# EAGLE design M307 (EAGLE 6.6.0)
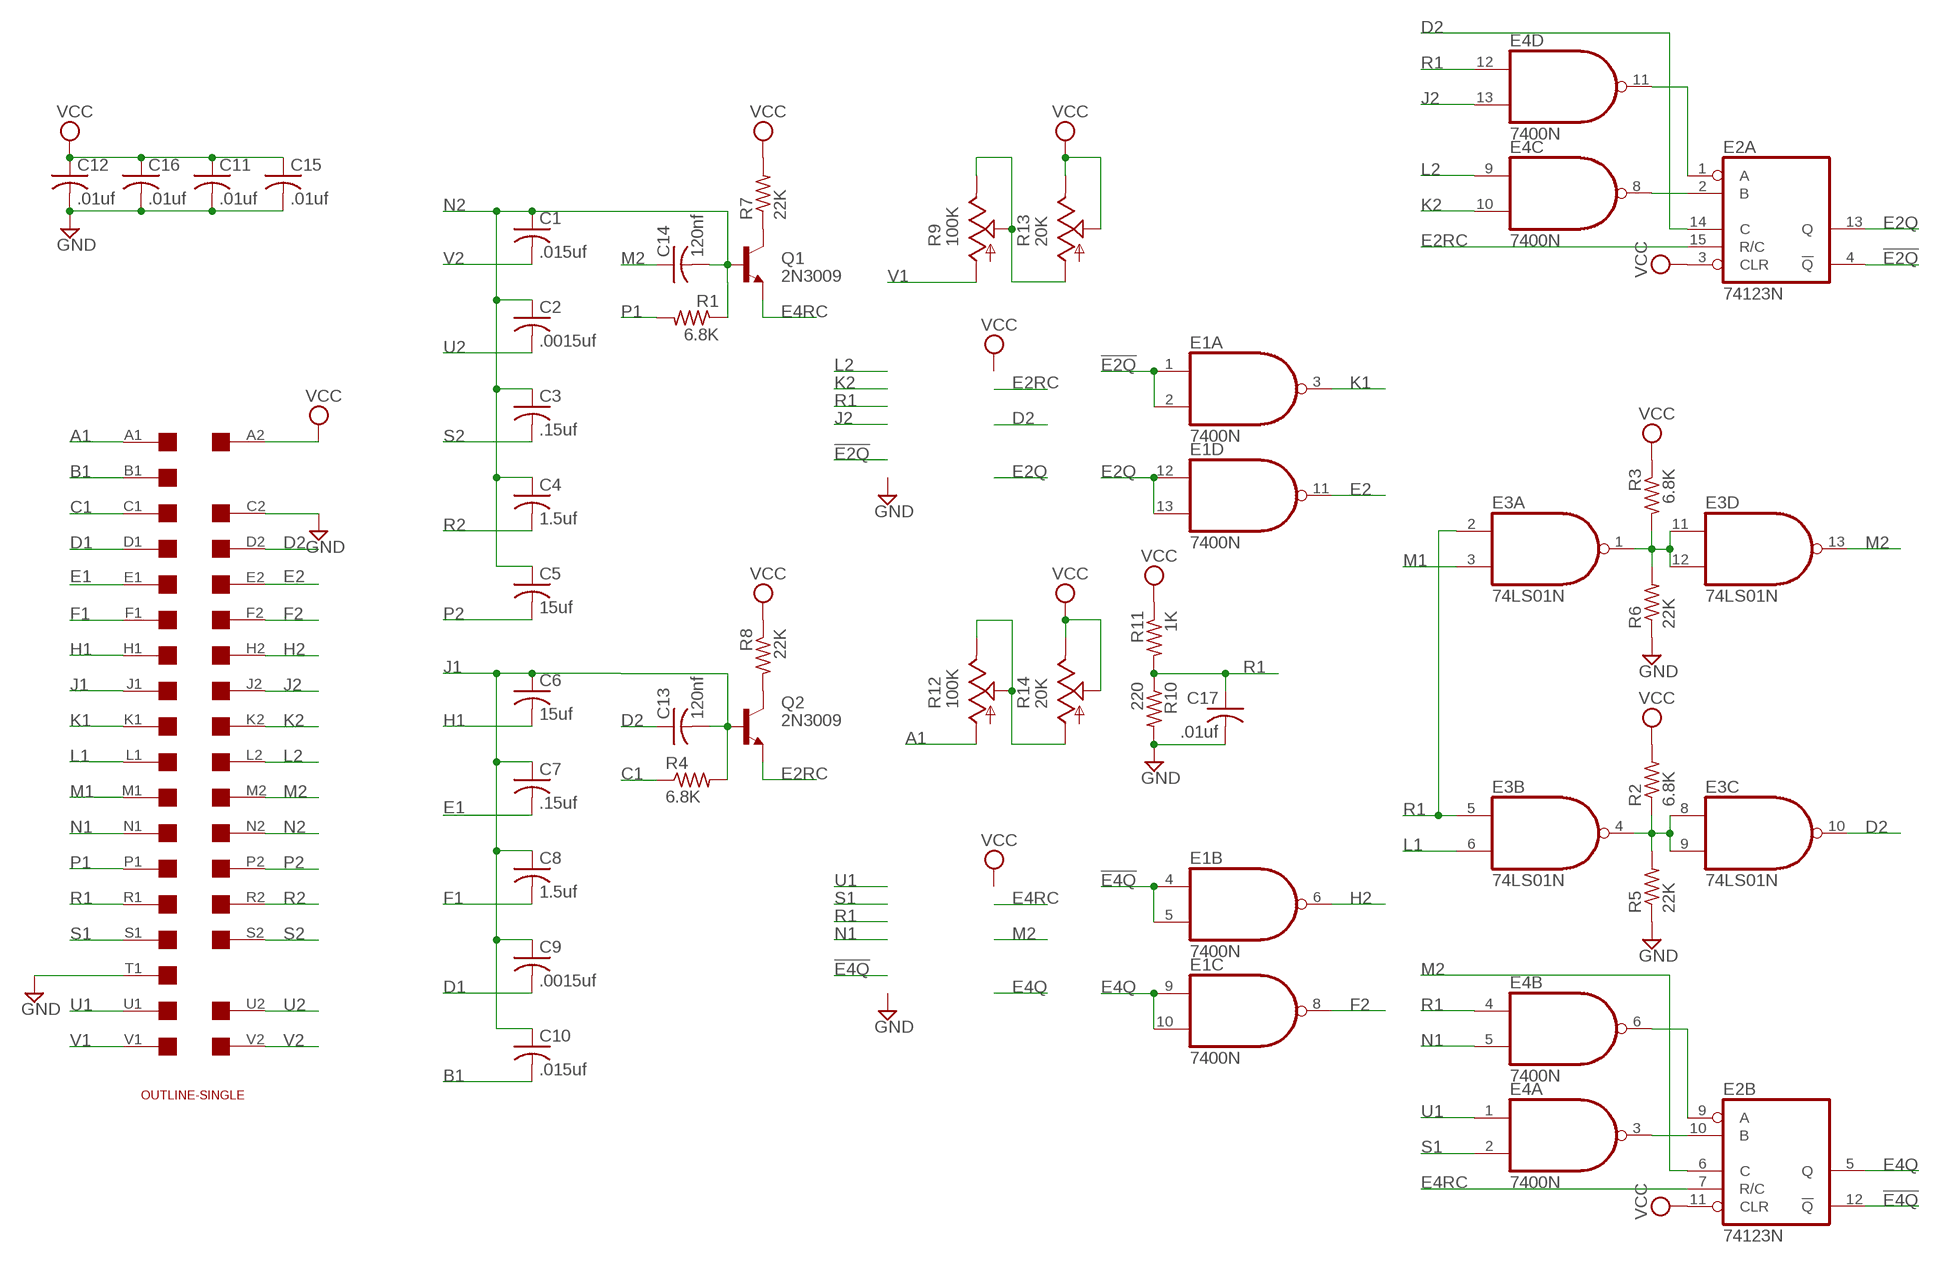
[diagram p0: schematic, sheet 1]

## Parts
C1  .015uf  C-US150-054X183  [C150-054X183]
C2  .0015uf  C-US050-025X075  [C050-025X075]
C3  .15uf  C-US102-043X133  [C102-043X133]
C4  1.5uf  C-US150-054X183  [C150-054X183]
C5  15uf  C-US150-054X183  [C150-054X183]
C6  15uf  C-US150-054X183  [C150-054X183]
C7  .15uf  C-US102-043X133  [C102-043X133]
C8  1.5uf  C-US150-054X183  [C150-054X183]
C9  .0015uf  C-US050-025X075  [C050-025X075]
C10  .015uf  C-US150-054X183  [C150-054X183]
C11  .01uf  C-US050-025X075  [C050-025X075]
C12  .01uf  C-US050-025X075  [C050-025X075]
C13  120nf  C-US075-032X103  [C075-032X103]
C14  120nf  C-US075-032X103  [C075-032X103]
C15  .01uf  C-US050-025X075  [C050-025X075]
C16  .01uf  C-US050-025X075  [C050-025X075]
C17  .01uf  C-US050-025X075  [C050-025X075]
E1  7400N  [DIL14]
E2  74123N  [DIL16]
E3  74LS01N  [DIL14]
E4  7400N  [DIL14]
Q1  2N3009  2N3019-NPN-TO39-EBC  [TO39]
Q2  2N3009  2N3019-NPN-TO39-EBC  [TO39]
R1  6.8K  R-US_0207/10  [0207/10]
R2  6.8K  R-US_0207/10  [0207/10]
R3  6.8K  R-US_0207/10  [0207/10]
R4  6.8K  R-US_0207/10  [0207/10]
R5  22K  R-US_0207/10  [0207/10]
R6  22K  R-US_0207/10  [0207/10]
R7  22K  R-US_0207/10  [0207/10]
R8  22K  R-US_0207/10  [0207/10]
R9  100K  TRIM_US-PTSPIN  [PT-SPIN]
R10  220  R-US_0207/10  [0207/10]
R11  1K  R-US_0207/10  [0207/10]
R12  100K  TRIM_US-PTSPIN  [PT-SPIN]
R13  20K  TRIM_US-PTSPIN  [PT-SPIN]
R14  20K  TRIM_US-PTSPIN  [PT-SPIN]
U$1  SINGLE  [EDGE-CON2]
U$4  OUTLINE-SINGLE  [SINGLE]

## Nets
!E2Q: E1.1(A:I0) E1.2(A:I1) E2.4(A:!Q)
!E4Q: E1.4(B:I0) E1.5(B:I1) E2.12(B:!Q)
A1: R12.A U$1.A1
B1: C10.2 U$1.B1
C1: R4.1 U$1.C1
D1: C9.2 U$1.D1
D2: C13.1 E2.14(A:C) E3.10(C:O) U$1.D2
E1: C7.2 U$1.E1
E2: E1.11(D:O) U$1.E2
E2Q: E1.12(D:I0) E1.13(D:I1) E2.13(A:Q)
E2RC: E2.15(A:R/C) Q2.1(E)
E4Q: E1.9(C:I0) E1.10(C:I1) E2.5(B:Q)
E4RC: E2.7(B:R/C) Q1.1(E)
F1: C8.2 U$1.F1
F2: E1.8(C:O) U$1.F2
GND [power]: C11.2 C12.2 C15.2 C16.2 C17.2 R5.1 R6.1 R10.2 U$1.C2 U$1.T1
H1: C6.2 U$1.H1
H2: E1.6(B:O) U$1.H2
J1: C6.1 C7.1 C8.1 C9.1 C10.1 C13.2 Q2.2(B) R4.2 U$1.J1
J2: E4.13(D:I1) U$1.J2
K1: E1.3(A:O) U$1.K1
K2: E4.10(C:I1) U$1.K2
L1: E3.6(B:I1) U$1.L1
L2: E4.9(C:I0) U$1.L2
M1: E3.3(A:I1) U$1.M1
M2: C14.1 E2.6(B:C) E3.13(D:O) U$1.M2
N1: E4.5(B:I1) U$1.N1
N2: C1.1 C2.1 C3.1 C4.1 C5.1 C14.2 Q1.2(B) R1.1 U$1.N2
N$1: Q1.3(C) R7.1
N$2: E3.4(B:O) E3.8(C:I0) E3.9(C:I1) R2.1 R5.2
N$3: Q2.3(C) R8.2
N$4: E2.10(B:B) E4.3(A:O)
N$5: E3.1(A:O) E3.11(D:I0) E3.12(D:I1) R3.2 R6.2
N$6: E2.9(B:A) E4.6(B:O)
N$7: E2.1(A:A) E4.11(D:O)
N$8: E2.2(A:B) E4.8(C:O)
N$9 [power]: R9.E R9.S R13.A
N$10 [power]: R12.E R12.S R14.A
P1: R1.2 U$1.P1
P2: C5.2 U$1.P2
R1: C17.1 E3.2(A:I0) E3.5(B:I0) E4.4(B:I0) E4.12(D:I0) R10.1 R11.2 U$1.R1
R2: C4.2 U$1.R2
S1: E4.2(A:I1) U$1.S1
S2: C3.2 U$1.S2
U1: E4.1(A:I0) U$1.U1
U2: C2.2 U$1.U2
V1: R9.A U$1.V1
V2: C1.2 U$1.V2
VCC [power]: C11.1 C12.1 C15.1 C16.1 E2.3(A:CLR) E2.11(B:CLR) R2.2 R3.1 R7.2 R8.1 R11.1 R13.E R13.S R14.E R14.S U$1.A2
Unconnected: U$1.B2 U$1.T2

## Power pins joined to a net without a drawn wire
GND: E1.7(P:GND) E2.8(P:GND) E3.7(P:GND) E4.7(P:GND)
VCC: E1.14(P:VCC) E2.16(P:VCC) E3.14(P:VCC) E4.14(P:VCC)

## Library data of the parts
C1-C17 = rcl:C-US: CAPACITOR, American symbol
E1 E4 = 74xx-us:74*00: Quad 2-input NAND gate
E2 = 74xx-us:74*123: Retriggerable monostable MULTIVIBRATOR
E3 = 74xx-us:74*01: Quad 2-input NAND gate, open collector
Q1 Q2 = transistor:*-NPN-: NPN Transistror BF959 corrected 2008.03.06
R1-R8 R10 R11 = rcl:R-US_: RESISTOR, American symbol
R9 R12-R14 = pot:TRIM_US-: POTENTIOMETER
U$1 = dec-con:SINGLE: Single-Height DEC board
U$4 = dec-con:OUTLINE-*: Board outlines for DEC boards.

## Net classes
1 power: width 0.508 mm, clearance 0.508 mm

## Board
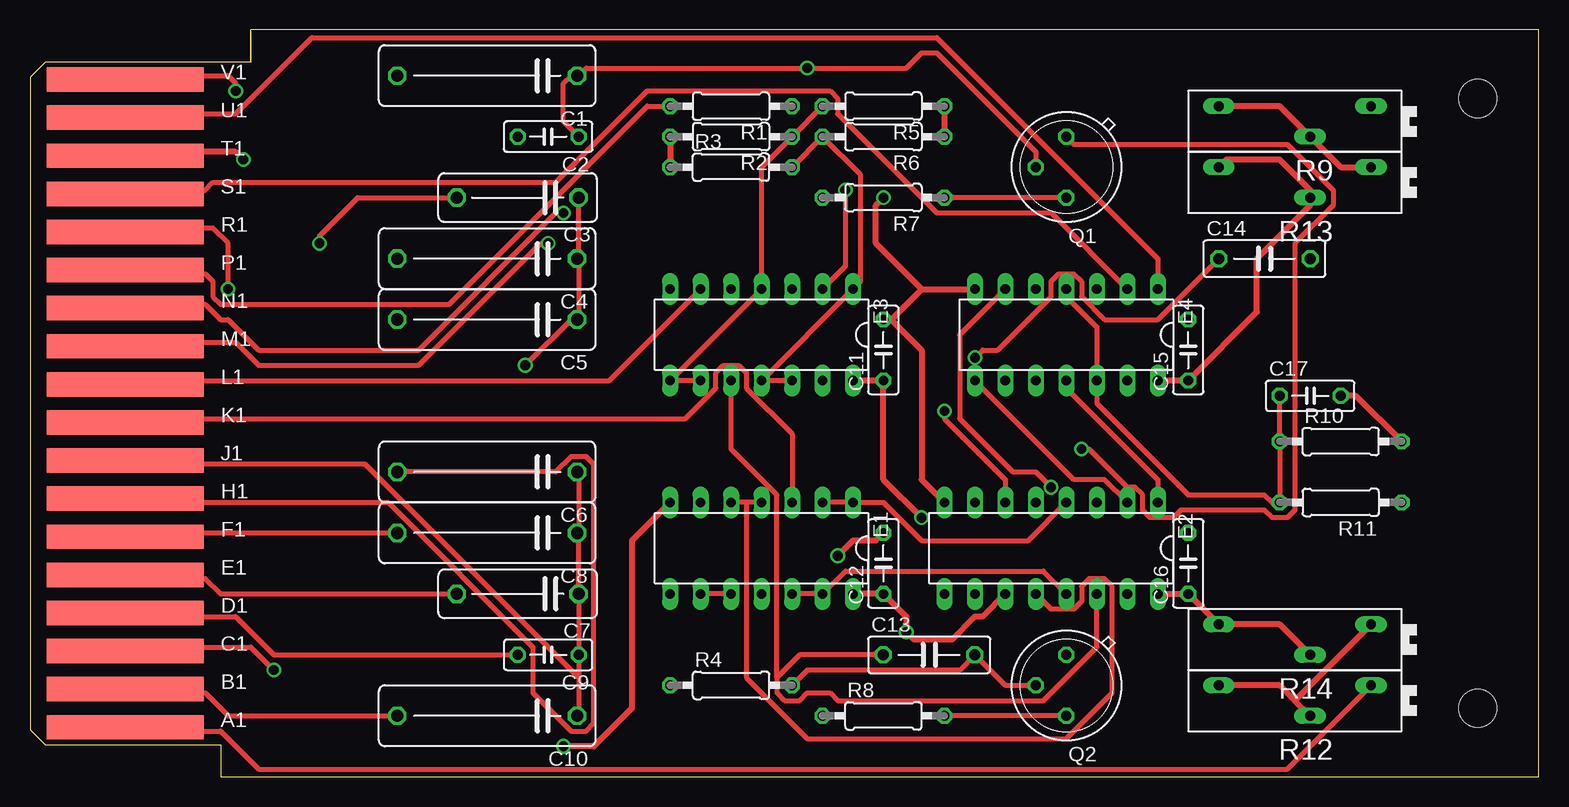
[diagram p1: board, top side]
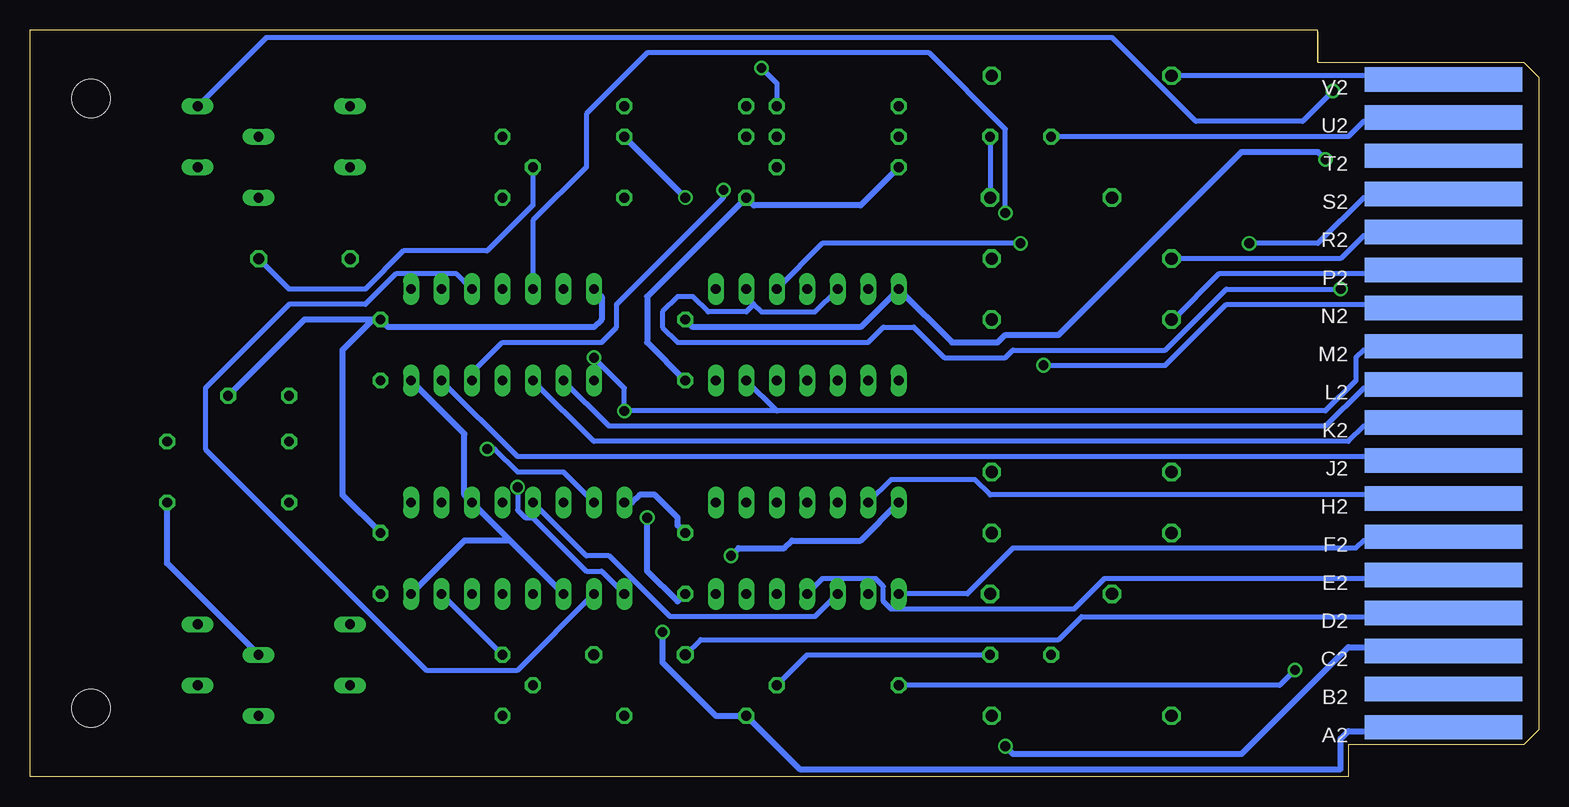
[diagram p2: board, bottom side, seen from below]

Size 125.73 x 62.23 mm. Coordinates in mm from the lower left corner, seen from the top.
Copper layers (1+16): Top 0.035mm / dielectric 1.5mm / Bottom 0.035mm
Design rules "16mils": minimum track width 16mil, minimum drill 32mil, track to track 15mil, track to pad 10mil, pad to pad 10mil, via to via 10mil, smd to smd 10mil, copper to edge 13mil, drill to drill 10mil, minimum pad ring 10mil, minimum via ring 8mil, stop-mask expansion 0mil, vias tented up to drill 0mil, thermal gap 10mil

### Footprints (pad centres in the part's own frame; a part is rotated, then mirrored left to right if it is on the bottom)
C150-054X183 = drill 1.016 octagon: 1 -7.493,0; 2 7.493,0
C050-025X075 = drill 0.813 octagon: 1 -2.54,0; 2 2.54,0
C102-043X133 = drill 1.016 octagon: 1 -5.08,0; 2 5.08,0
C075-032X103 = drill 0.914 octagon: 1 -3.81,0; 2 3.81,0
DIL14 = drill 0.813 long: 1 -7.62,-3.81; 2 -5.08,-3.81; 3 -2.54,-3.81; 4 0,-3.81; 5 2.54,-3.81; 6 5.08,-3.81; 7 7.62,-3.81; 8 7.62,3.81; 9 5.08,3.81; 10 2.54,3.81; 11 0,3.81; 12 -2.54,3.81; 13 -5.08,3.81; 14 -7.62,3.81
DIL16 = drill 0.813 long: 1 -8.89,-3.81; 2 -6.35,-3.81; 3 -3.81,-3.81; 4 -1.27,-3.81; 5 1.27,-3.81; 6 3.81,-3.81; 7 6.35,-3.81; 8 8.89,-3.81; 9 8.89,3.81; 10 6.35,3.81; 11 3.81,3.81; 12 1.27,3.81; 13 -1.27,3.81; 14 -3.81,3.81; 15 -6.35,3.81; 16 -8.89,3.81
TO39 = drill 0.813 octagon: 1 0,-2.54; 2 2.54,0; 3 0,2.54
0207/10 = drill 0.813 octagon: 1 -5.08,0; 2 5.08,0
PT-SPIN = drill 0.813 long: A -6.35,-1.27; E 6.35,-1.27; S -1.27,1.27
EDGE-CON2 = smd 13.106 x 2.032: A1 7.938,4.128; B1 7.938,7.303; C1 7.938,10.477; D1 7.938,13.652; E1 7.938,16.828; F1 7.938,20.003; H1 7.938,23.177; J1 7.938,26.352; K1 7.938,29.527; L1 7.938,32.703; M1 7.938,35.877; N1 7.938,39.053; P1 7.938,42.227; R1 7.938,45.403; S1 7.938,48.578; T1 7.938,51.752; U1 7.938,54.928; V1 7.938,58.102 | smd 13.106 x 2.032 bottom: A2 7.938,4.128; B2 7.938,7.303; C2 7.938,10.477; D2 7.938,13.652; E2 7.938,16.828; F2 7.938,20.003; H2 7.938,23.177; J2 7.938,26.352; K2 7.938,29.527; L2 7.938,32.703; M2 7.938,35.877; N2 7.938,39.053; P2 7.938,42.227; R2 7.938,45.403; S2 7.938,48.578; T2 7.938,51.752; U2 7.938,54.928; V2 7.938,58.102
SINGLE = hole 3.175: 120.65,56.515; 120.65,5.715

### Placement (x,y rotation side)
C1  38.1,58.42 180 top
C2  43.18,53.34 180 top
C3  40.64,48.26 180 top
C4  38.1,43.18 180 top
C5  38.1,38.1 180 top
C6  38.1,25.4 180 top
C7  40.64,15.24 180 top
C8  38.1,20.32 180 top
C9  43.18,10.16 180 top
C10  38.1,5.08 180 top
C11  71.12,35.56 90 top
C12  71.12,17.78 90 top
C13  74.93,10.16 0 top
C14  102.87,43.18 0 top
C15  96.52,35.56 90 top
C16  96.52,17.78 90 top
C17  106.68,31.75 0 top
E1  60.96,19.05 180 top
E2  85.09,19.05 180 top
E3  60.96,36.83 180 top
E4  86.36,36.83 180 top
Q1  86.36,50.8 180 top
Q2  86.36,7.62 180 top
R1  58.42,55.88 180 top
R2  58.42,53.34 180 top
R3  58.42,50.8 0 top
R4  58.42,7.62 0 top
R5  71.12,55.88 180 top
R6  71.12,53.34 180 top
R7  71.12,48.26 180 top
R8  71.12,5.08 0 top
R9  105.41,54.61 180 top
R10  109.22,27.94 0 top
R11  109.22,22.86 180 top
R12  105.41,6.35 180 top
R13  105.41,49.53 180 top
R14  105.41,11.43 180 top
U$1  0,0 0 top
U$4  0,0 0 top

### Tracks (layer width: path | path; a pad name or v marks a point on that pad's centre or on a via)
!E2Q
  Top 0.406: E1.2 E1.1 71.12,22.86 74.3,19.68 83.19,19.68 E2.4
!E4Q
  Top 0.406: E1.4 59.69,22.86 | 59.69,22.86 E1.5 | E2.12 85.09,13.97 87,13.97 87.63,14.61 87.63,15.88 88.27,16.51 89.54,16.51 90.17,15.88 90.17,6.99 86.36,3.17 64.77,3.17 59.69,8.26 59.69,22.86
A1
  Top 0.406: R12.A 104.78,0.64 19.05,0.64 15.88,3.81 8.26,3.81 U$1.A1
B1
  Top 0.406: C10.2 16.51,5.08 14.61,6.99 8.26,6.99 U$1.B1
C1  (via drill 0.81)
  Top 0.406: v20.32,8.89 18.42,10.79 8.26,10.79 U$1.C1
  Bottom 0.406: R4.1 21.59,7.62 v20.32,8.89
D1
  Top 0.406: C9.2 20.32,10.16 17.15,13.34 8.26,13.34 U$1.D1
D2
  Top 0.406: E2.14 88.9,10.79 84.46,6.35 67.31,6.35 66.68,6.99 64.77,6.99 64.14,6.35 62.87,6.35 62.23,6.99 62.23,8.26 | 62.23,8.26 64.14,10.16 C13.1 | E3.10 58.42,27.3 62.23,23.5 62.23,8.26
  Bottom 0.406: C13.1 69.85,11.43 40.01,11.43 38.1,13.34 8.26,13.34 U$1.D2
E1
  Top 0.406: C7.2 15.88,15.24 14.61,16.51 8.26,16.51 U$1.E1
E2
  Bottom 0.406: E1.11 59.69,16.51 55.25,16.51 54.61,15.88 54.61,14.61 53.98,13.97 38.74,13.97 36.2,16.51 8.26,16.51 U$1.E2
E2Q
  Top 0.406: E1.12 E1.13 67.95,17.14 84.46,17.14 E2.13
E2RC
  Bottom 0.406: E2.15 Q2.1
E4Q
  Top 0.406: E1.10 E1.9
  Bottom 0.406: E2.5 79.38,18.41 77.47,18.41 72.39,13.34 60.33,13.34 E1.10
E4RC  (via drill 0.81)
  Top 0.406: v87.63,27.3 88.27,27.3 91.44,24.13 92.08,24.13 92.71,23.5 92.71,22.23 93.35,21.59 95.25,21.59 95.89,22.23 102.87,22.23 103.51,21.59 104.78,21.59 105.41,22.23 105.41,44.45 108.59,47.62 108.59,48.9 104.78,52.7 87,52.7 Q1.1
  Bottom 0.406: E2.7 81.28,25.4 85.09,25.4 87,27.3 v87.63,27.3
F1
  Top 0.406: C8.2 8.26,20.32 U$1.F1
F2
  Bottom 0.406: E1.8 47.63,15.24 43.82,19.05 15.24,19.05 14.61,19.68 8.26,19.68 U$1.F2
GND  (via drill 0.81)
  Top 0.508: C17.2 110.49,31.75 R10.2 | v67.31,18.41 68.58,19.68 70.49,19.68 C12.2 | R5.1 R6.1 | 74.3,40.64 E4.7 | 71.76,38.1 74.3,40.64 | v71.12,48.26 70.49,47.62 70.49,44.45 74.3,40.64 | E2.8 74.3,24.77 74.3,35.56 71.76,38.1 | 71.76,38.1 C11.2 | v44.45,2.54 46.99,2.54 50.17,5.71 50.17,19.68 E1.7 | v17.78,51.44 17.15,52.07 8.26,52.07 U$1.T1
  Bottom 0.508: C16.2 99.7,23.5 99.7,35.56 97.16,38.1 | C17.2 102.87,38.1 97.16,38.1 | 97.16,38.1 C15.2 95.89,37.47 78.74,37.47 78.11,38.1 78.11,40.01 E4.7 | E2.8 75.57,22.86 74.93,23.5 73.66,23.5 71.76,21.59 71.76,20.95 C12.2 | E1.7 56.52,19.68 62.23,19.68 62.87,19.05 66.68,19.05 v67.31,18.41 | C11.2 70.49,37.47 56.52,37.47 E3.7 48.9,36.2 45.09,36.2 44.45,36.83 40.01,36.83 24.77,52.07 18.42,52.07 v17.78,51.44 | v71.12,48.26 R6.1 | v44.45,2.54 43.82,1.91 24.77,1.91 15.88,10.79 8.26,10.79 U$1.C2
H1
  Top 0.406: C6.2 43.82,25.4 45.09,26.67 46.36,26.67 46.99,26.04 46.99,4.45 46.36,3.81 45.09,3.81 41.91,6.99 41.91,10.79 29.85,22.86 8.26,22.86 U$1.H1
H2
  Bottom 0.406: E1.6 53.98,24.77 46.99,24.77 45.72,23.5 8.26,23.5 U$1.H2
J1
  Top 0.406: 45.72,20.32 45.72,25.4 C6.1 | 45.72,8.26 C9.1 C7.1 45.72,20.32 | 45.72,8.26 45.72,5.08 C10.1 | 45.72,20.32 C8.1 | R4.2 64.77,8.89 77.47,8.89 C13.2 81.28,7.62 Q2.2 | 45.72,8.26 27.94,26.04 8.26,26.04 U$1.J1
  Bottom 0.406: C9.1 60.96,10.16 R4.2
J2
  Bottom 0.406: E4.13 85.09,26.67 8.26,26.67 U$1.J2
K1
  Top 0.406: E1.3 63.5,28.57 59.69,32.38 59.69,33.66 59.06,34.29 57.79,34.29 57.15,33.66 57.15,32.38 54.61,29.84 8.26,29.84 U$1.K1
K2
  Bottom 0.406: E4.10 78.74,27.94 15.88,27.94 14.61,29.21 8.26,29.21 U$1.K2
L1
  Top 0.406: E3.6 48.26,33.02 8.26,33.02 U$1.L1
L2
  Bottom 0.406: E4.9 77.47,29.21 17.78,29.21 14.61,32.38 8.26,32.38 U$1.L2
M1  (via drill 0.81)
  Top 0.406: v43.18,44.45 42.55,44.45 32.39,34.29 19.05,34.29 17.15,36.2 8.26,36.2 U$1.M1
  Bottom 0.406: E3.3 59.69,44.45 v43.18,44.45
M2  (via drill 0.81)
  Top 0.406: E2.6 81.28,24.77 76.2,29.84 v76.2,30.48 | C14.1 93.98,38.1 89.54,38.1 87.63,40.01 87.63,41.27 87,41.91 85.73,41.91 85.09,41.27 85.09,40.01 80.65,35.56 79.38,35.56 v78.74,34.92
  Bottom 0.406: 63.5,30.48 E3.13 | 63.5,30.48 17.78,30.48 15.24,33.02 15.24,34.92 14.61,35.56 12.07,35.56 11.43,36.2 8.26,36.2 U$1.M2 | 63.5,30.48 v76.2,30.48 76.2,32.38 v78.74,34.92
N1  (via drill 0.81)
  Top 0.406: v44.45,46.99 43.82,46.99 32.39,35.56 19.05,35.56 16.51,38.1 15.88,38.1 14.61,39.37 8.26,39.37 U$1.N1
  Bottom 0.406: E4.5 83.82,46.35 79.38,50.8 79.38,55.24 74.3,60.33 50.8,60.33 44.45,53.98 v44.45,46.99
N2  (via drill 0.81)
  Top 0.406: 45.72,43.18 45.72,38.1 C5.1 45.09,38.1 v41.28,34.29 | 45.72,43.18 C3.1 | 45.72,43.18 C4.1 | C2.1 44.45,54.61 44.45,57.78 45.09,58.42 C1.1 45.72,58.42 46.36,59.05 v64.77,59.05 73.03,59.05 74.3,60.33 75.57,60.33 83.82,52.07 Q1.2
  Bottom 0.406: R1.1 63.5,57.78 v64.77,59.05 | C14.2 104.14,40.64 97.79,40.64 94.62,43.81 87.63,43.81 83.82,47.62 Q1.2 | C2.1 C3.1 | v41.28,34.29 31.12,34.29 26.04,39.37 8.26,39.37 U$1.N2
N$1
  Top 0.406: Q1.3 R7.1
N$2
  Top 0.406: R5.2 R2.1 60.96,50.8 E3.4 E3.8 E3.9
N$3
  Top 0.406: Q2.3 R8.2
N$4
  Bottom 0.406: E2.10 85.09,8.89 92.71,8.89 111.13,27.3 111.13,32.38 104.14,39.37 97.79,39.37 95.25,41.91 90.17,41.91 E4.3
N$5
  Top 0.406: R3.2 R6.2 69.22,50.16 69.22,41.27 E3.1 E3.11 E3.12
N$6  (via drill 0.81)
  Top 0.406: v85.09,24.13 83.82,25.4 81.92,25.4 77.47,29.84 77.47,36.83 E4.6
  Bottom 0.406: E2.9 78.11,17.14 79.38,17.14 83.82,21.59 84.46,21.59 85.09,22.23 v85.09,24.13
N$7
  Top 0.406: E2.1 93.98,24.77 86.36,32.38 E4.11
N$8
  Top 0.406: E4.8 87,24.77 89.54,24.77 E2.2
N$9
  Top 0.508: R9.E 104.14,55.88 R9.S 109.22,50.8 R13.A
N$10
  Top 0.508: R12.E 104.14,7.62 105.41,6.35 | R12.S 105.41,6.35 | 105.41,6.35 R14.A
P1
  Top 0.406: R1.2 51.44,55.88 34.93,39.37 15.88,39.37 15.24,40.01 15.24,41.27 14.61,41.91 8.26,41.91 U$1.P1
P2
  Bottom 0.406: C5.2 30.48,38.1 26.67,41.91 8.26,41.91 U$1.P2
R1  (via drill 0.81)
  Top 0.406: C17.1 R10.1 R11.2 103.51,22.86 102.87,23.5 96.52,23.5 88.9,31.11 E4.12 88.9,37.47 86.36,40.01 E4.4 | E3.2 67.95,42.55 v67.95,48.9 | v16.51,40.64 16.51,44.45 15.24,45.72 8.26,45.72 U$1.R1
  Bottom 0.406: E3.5 60.33,38.73 64.77,38.73 65.41,39.37 | 65.41,39.37 66.04,40.01 E3.2 | v67.95,48.9 67.95,48.26 76.84,39.37 76.84,37.47 78.11,36.2 86.36,36.2 88.9,33.66 E4.12 | v16.51,40.64 26.04,40.64 31.12,35.56 43.82,35.56 44.45,34.92 49.53,34.92 52.07,37.47 54.61,37.47 55.88,36.2 71.76,36.2 73.03,37.47 73.03,38.73 71.76,40.01 70.49,40.01 69.22,38.73 66.04,38.73 65.41,39.37
R2
  Bottom 0.406: C4.2 16.51,43.18 14.61,45.09 8.26,45.09 U$1.R2
S1
  Top 0.406: E4.2 85.09,46.99 75.57,46.99 67.31,55.24 67.31,56.52 66.68,57.15 51.44,57.15 43.82,49.53 15.24,49.53 14.61,48.9 8.26,48.9 U$1.S1
S2  (via drill 0.81)
  Top 0.406: C3.2 27.31,48.26 24.13,45.09 v24.13,44.45
  Bottom 0.406: v24.13,44.45 18.42,44.45 14.61,48.26 12.07,48.26 11.43,48.9 8.26,48.9 U$1.S2
U1
  Top 0.406: E4.1 93.98,43.18 75.57,61.59 23.5,61.59 17.15,55.24 8.26,55.24 U$1.U1
U2
  Bottom 0.406: C2.2 15.88,53.34 14.61,54.61 8.26,54.61 U$1.U2
V1  (via drill 0.81)
  Top 0.406: v17.15,57.15 17.15,57.78 16.51,58.42 8.26,58.42 U$1.V1
  Bottom 0.406: R9.A 106.05,61.59 35.56,61.59 28.58,54.61 19.69,54.61 v17.15,57.15
V2
  Bottom 0.406: C1.2 8.26,58.42 U$1.V2
VCC  (via drill 0.81)
  Top 0.508: E3.14 C11.1 71.12,24.77 v74.3,21.59 | R2.2 R3.1 | E2.16 C16.1 R14.E 104.14,12.7 R14.S | E1.14 C12.1 73.03,13.34 v73.03,12.06 73.66,11.43 76.84,11.43 78.74,13.34 79.38,13.34 E2.11 | R13.E 99.7,51.44 104.14,51.44 106.68,48.9 R13.S 106.68,47.62 102.24,43.18 102.24,38.73 C15.1 E4.14
  Bottom 0.508: R3.1 56.52,47.62 65.41,47.62 R7.2 74.3,40.01 74.3,36.2 C11.1 | R11.1 114.3,17.78 R14.S | v73.03,12.06 73.03,9.53 68.58,5.08 R8.1 61.6,0.64 16.51,0.64 16.51,3.17 15.88,3.81 8.26,3.81 U$1.A2 | 85.73,19.68 E2.3 89.54,23.5 89.54,28.57 E4.14 | 85.73,19.68 E2.11 | E2.16 89.54,19.68 85.73,19.68 | v74.3,21.59 74.3,17.14 71.76,14.61 C12.1

### Text on the board
tValues: Coarse | Fine | Fine | Coarse